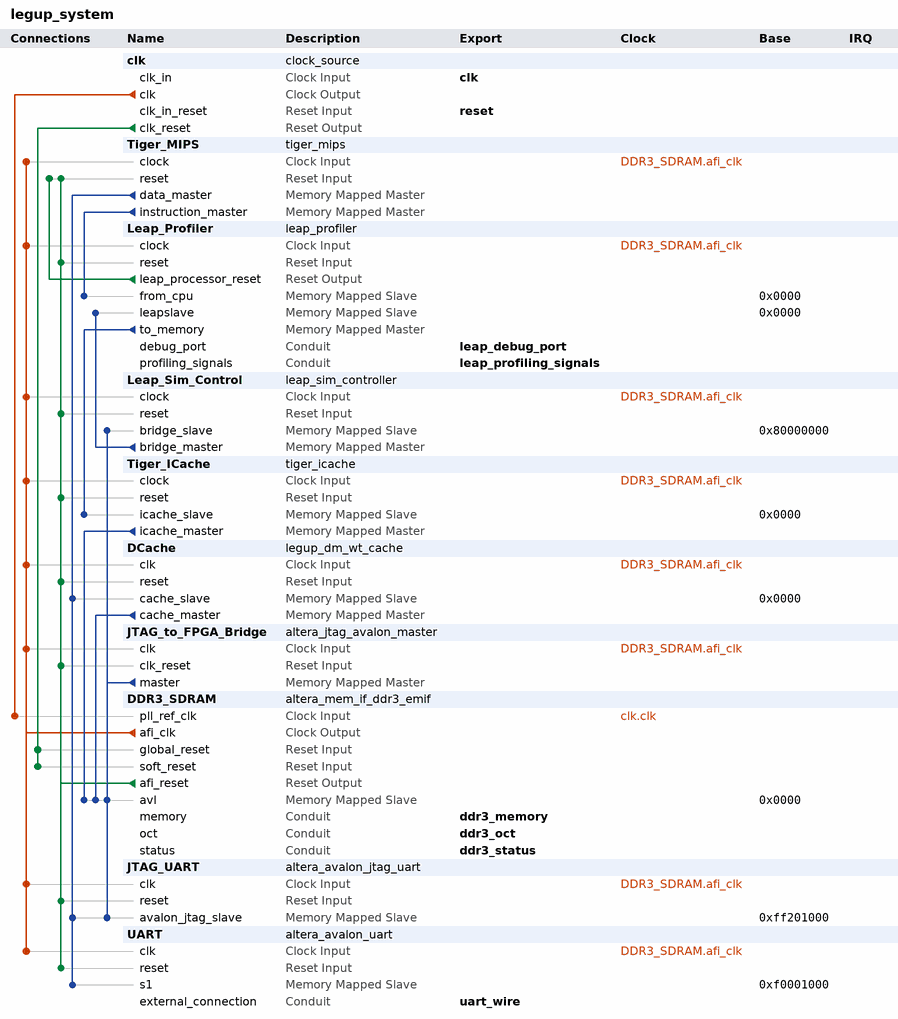
[diagram p0: system contents]
# Platform Designer (Qsys) system legup_system, Stratix V 5SGXEA7N2F45C2
# Parameters at their usual value, and those the tool derives, are not listed.
package require -exact qsys 15.0
create_system legup_system
set_project_property DEVICE_FAMILY {Stratix V}
set_project_property DEVICE 5SGXEA7N2F45C2

add_instance clk clock_source 15.0
set_instance_parameter_value clk clockFrequency 50000000

add_instance Tiger_MIPS tiger_mips 1.0
set_instance_parameter_value Tiger_MIPS RESET_ADDRESS 1073741824

add_instance Leap_Profiler leap_profiler 1.0
set_instance_parameter_value Leap_Profiler STARTING_PC 1073741856
set_instance_parameter_value Leap_Profiler prof_param_CW 32
set_instance_parameter_value Leap_Profiler prof_param_N2 8
set_instance_parameter_value Leap_Profiler prof_param_S2 5

add_instance Leap_Sim_Control leap_sim_controller 1.0
set_instance_parameter_value Leap_Sim_Control N2 8
set_instance_parameter_value Leap_Sim_Control STARTING_PC 1073741856

add_instance Tiger_ICache tiger_icache 1.0

add_instance DCache legup_dm_wt_cache 1.0

add_instance JTAG_to_FPGA_Bridge altera_jtag_avalon_master 15.0

add_instance DDR3_SDRAM altera_mem_if_ddr3_emif 15.0
set_instance_parameter_value DDR3_SDRAM AVL_MAX_SIZE 4
set_instance_parameter_value DDR3_SDRAM CALIBRATION_MODE Skip
set_instance_parameter_value DDR3_SDRAM CPORT_TYPE_PORT Bidirectional,Bidirectional,Bidirectional,Bidirectional,Bidirectional,Bidirectional
set_instance_parameter_value DDR3_SDRAM EXPORT_AFI_HALF_CLK false
set_instance_parameter_value DDR3_SDRAM HARD_EMIF false
set_instance_parameter_value DDR3_SDRAM MEM_BANKADDR_WIDTH 3
set_instance_parameter_value DDR3_SDRAM MEM_CLK_FREQ 800.0
set_instance_parameter_value DDR3_SDRAM MEM_CLK_FREQ_MAX 800.0
set_instance_parameter_value DDR3_SDRAM MEM_COL_ADDR_WIDTH 10
set_instance_parameter_value DDR3_SDRAM MEM_DQ_WIDTH 64
set_instance_parameter_value DDR3_SDRAM MEM_FORMAT UNBUFFERED
set_instance_parameter_value DDR3_SDRAM MEM_ROW_ADDR_WIDTH 14
set_instance_parameter_value DDR3_SDRAM MEM_TCL 11
set_instance_parameter_value DDR3_SDRAM MEM_TFAW_NS 30.0
set_instance_parameter_value DDR3_SDRAM MEM_TRAS_NS 35.0
set_instance_parameter_value DDR3_SDRAM MEM_TRCD_NS 13.75
set_instance_parameter_value DDR3_SDRAM MEM_TRFC_NS 160.0
set_instance_parameter_value DDR3_SDRAM MEM_TRP_NS 13.75
set_instance_parameter_value DDR3_SDRAM MEM_TRRD_NS 6.0
set_instance_parameter_value DDR3_SDRAM MEM_TRTP_NS 7.5
set_instance_parameter_value DDR3_SDRAM MEM_TWTR 4
set_instance_parameter_value DDR3_SDRAM MEM_VENDOR Micron
set_instance_parameter_value DDR3_SDRAM MEM_WTCL 8
set_instance_parameter_value DDR3_SDRAM PLL_LOCATION Top_Bottom
set_instance_parameter_value DDR3_SDRAM POWER_OF_TWO_BUS true
set_instance_parameter_value DDR3_SDRAM PRIORITY_PORT 1,1,1,1,1,1
set_instance_parameter_value DDR3_SDRAM RATE Quarter
set_instance_parameter_value DDR3_SDRAM REF_CLK_FREQ 50.0
set_instance_parameter_value DDR3_SDRAM SPEED_GRADE 2
set_instance_parameter_value DDR3_SDRAM TIMING_BOARD_AC_SKEW 0.05
set_instance_parameter_value DDR3_SDRAM TIMING_BOARD_AC_TO_CK_SKEW 0.012
set_instance_parameter_value DDR3_SDRAM TIMING_BOARD_DQ_TO_DQS_SKEW 0.002
set_instance_parameter_value DDR3_SDRAM TIMING_BOARD_MAX_CK_DELAY 1.78
set_instance_parameter_value DDR3_SDRAM TIMING_BOARD_MAX_DQS_DELAY 0.7
set_instance_parameter_value DDR3_SDRAM TIMING_BOARD_SKEW_BETWEEN_DQS 0.1
set_instance_parameter_value DDR3_SDRAM TIMING_BOARD_SKEW_CKDQS_DIMM_MAX 1.29
set_instance_parameter_value DDR3_SDRAM TIMING_BOARD_SKEW_CKDQS_DIMM_MIN 0.06
set_instance_parameter_value DDR3_SDRAM TIMING_BOARD_SKEW_WITHIN_DQS 0.009
set_instance_parameter_value DDR3_SDRAM TIMING_TDH 45
set_instance_parameter_value DDR3_SDRAM TIMING_TDQSCK 255
set_instance_parameter_value DDR3_SDRAM TIMING_TDQSQ 100
set_instance_parameter_value DDR3_SDRAM TIMING_TDQSS 0.27
set_instance_parameter_value DDR3_SDRAM TIMING_TDS 10
set_instance_parameter_value DDR3_SDRAM TIMING_TDSH 0.18
set_instance_parameter_value DDR3_SDRAM TIMING_TDSS 0.18
set_instance_parameter_value DDR3_SDRAM TIMING_TIH 120
set_instance_parameter_value DDR3_SDRAM TIMING_TIS 170
set_instance_parameter_value DDR3_SDRAM TIMING_TQSH 0.4
set_instance_parameter_value DDR3_SDRAM USER_DEBUG_LEVEL 0

add_instance JTAG_UART altera_avalon_jtag_uart 15.0
set_instance_parameter_value JTAG_UART simInteractiveOptions NO_INTERACTIVE_WINDOWS

add_instance UART altera_avalon_uart 15.0
set_instance_parameter_value UART baud 115200
set_instance_parameter_value UART dataBits 8
set_instance_parameter_value UART fixedBaud true
set_instance_parameter_value UART parity NONE
set_instance_parameter_value UART stopBits 1

# connections
add_connection clk.clk DDR3_SDRAM.pll_ref_clk clock
add_connection DDR3_SDRAM.afi_clk DCache.clk clock
add_connection DDR3_SDRAM.afi_clk JTAG_to_FPGA_Bridge.clk clock
add_connection DDR3_SDRAM.afi_clk JTAG_UART.clk clock
add_connection DDR3_SDRAM.afi_clk Leap_Profiler.clock clock
add_connection DDR3_SDRAM.afi_clk Leap_Sim_Control.clock clock
add_connection DDR3_SDRAM.afi_clk Tiger_ICache.clock clock
add_connection DDR3_SDRAM.afi_clk Tiger_MIPS.clock clock
add_connection DDR3_SDRAM.afi_clk UART.clk clock
add_connection clk.clk_reset DDR3_SDRAM.global_reset reset
add_connection clk.clk_reset DDR3_SDRAM.soft_reset reset
add_connection DDR3_SDRAM.afi_reset DCache.reset reset
add_connection DDR3_SDRAM.afi_reset JTAG_to_FPGA_Bridge.clk_reset reset
add_connection DDR3_SDRAM.afi_reset JTAG_UART.reset reset
add_connection DDR3_SDRAM.afi_reset Leap_Profiler.reset reset
add_connection DDR3_SDRAM.afi_reset Leap_Sim_Control.reset reset
add_connection DDR3_SDRAM.afi_reset Tiger_ICache.reset reset
add_connection DDR3_SDRAM.afi_reset Tiger_MIPS.reset reset
add_connection DDR3_SDRAM.afi_reset UART.reset reset
add_connection Leap_Profiler.leap_processor_reset Tiger_MIPS.reset reset
add_connection DCache.cache_master DDR3_SDRAM.avl avalon
set_connection_parameter_value DCache.cache_master/DDR3_SDRAM.avl baseAddress 0x0000
add_connection JTAG_to_FPGA_Bridge.master DDR3_SDRAM.avl avalon
set_connection_parameter_value JTAG_to_FPGA_Bridge.master/DDR3_SDRAM.avl baseAddress 0x0000
add_connection JTAG_to_FPGA_Bridge.master JTAG_UART.avalon_jtag_slave avalon
set_connection_parameter_value JTAG_to_FPGA_Bridge.master/JTAG_UART.avalon_jtag_slave baseAddress 0xff201000
add_connection JTAG_to_FPGA_Bridge.master Leap_Sim_Control.bridge_slave avalon
set_connection_parameter_value JTAG_to_FPGA_Bridge.master/Leap_Sim_Control.bridge_slave baseAddress 0x80000000
add_connection Leap_Profiler.to_memory Tiger_ICache.icache_slave avalon
set_connection_parameter_value Leap_Profiler.to_memory/Tiger_ICache.icache_slave baseAddress 0x0000
add_connection Leap_Sim_Control.bridge_master Leap_Profiler.leapslave avalon
set_connection_parameter_value Leap_Sim_Control.bridge_master/Leap_Profiler.leapslave baseAddress 0x0000
add_connection Tiger_ICache.icache_master DDR3_SDRAM.avl avalon
set_connection_parameter_value Tiger_ICache.icache_master/DDR3_SDRAM.avl baseAddress 0x0000
add_connection Tiger_MIPS.data_master DCache.cache_slave avalon
set_connection_parameter_value Tiger_MIPS.data_master/DCache.cache_slave baseAddress 0x0000
add_connection Tiger_MIPS.data_master JTAG_UART.avalon_jtag_slave avalon
set_connection_parameter_value Tiger_MIPS.data_master/JTAG_UART.avalon_jtag_slave baseAddress 0xff201000
add_connection Tiger_MIPS.data_master UART.s1 avalon
set_connection_parameter_value Tiger_MIPS.data_master/UART.s1 baseAddress 0xf0001000
add_connection Tiger_MIPS.instruction_master Leap_Profiler.from_cpu avalon
set_connection_parameter_value Tiger_MIPS.instruction_master/Leap_Profiler.from_cpu baseAddress 0x0000

# exported interfaces
add_interface clk clock sink
set_interface_property clk EXPORT_OF clk.clk_in
add_interface ddr3_memory conduit end
set_interface_property ddr3_memory EXPORT_OF DDR3_SDRAM.memory
add_interface ddr3_oct conduit end
set_interface_property ddr3_oct EXPORT_OF DDR3_SDRAM.oct
add_interface ddr3_status conduit end
set_interface_property ddr3_status EXPORT_OF DDR3_SDRAM.status
add_interface leap_debug_port conduit end
set_interface_property leap_debug_port EXPORT_OF Leap_Profiler.debug_port
add_interface leap_profiling_signals conduit end
set_interface_property leap_profiling_signals EXPORT_OF Leap_Profiler.profiling_signals
add_interface reset reset sink
set_interface_property reset EXPORT_OF clk.clk_in_reset
add_interface uart_wire conduit end
set_interface_property uart_wire EXPORT_OF UART.external_connection

set_interconnect_requirement {$system} qsys_mm.clockCrossingAdapter HANDSHAKE
set_interconnect_requirement {$system} qsys_mm.enableEccProtection FALSE
set_interconnect_requirement {$system} qsys_mm.insertDefaultSlave FALSE
set_interconnect_requirement {$system} qsys_mm.maxAdditionalLatency 1

save_system legup_system.qsys
